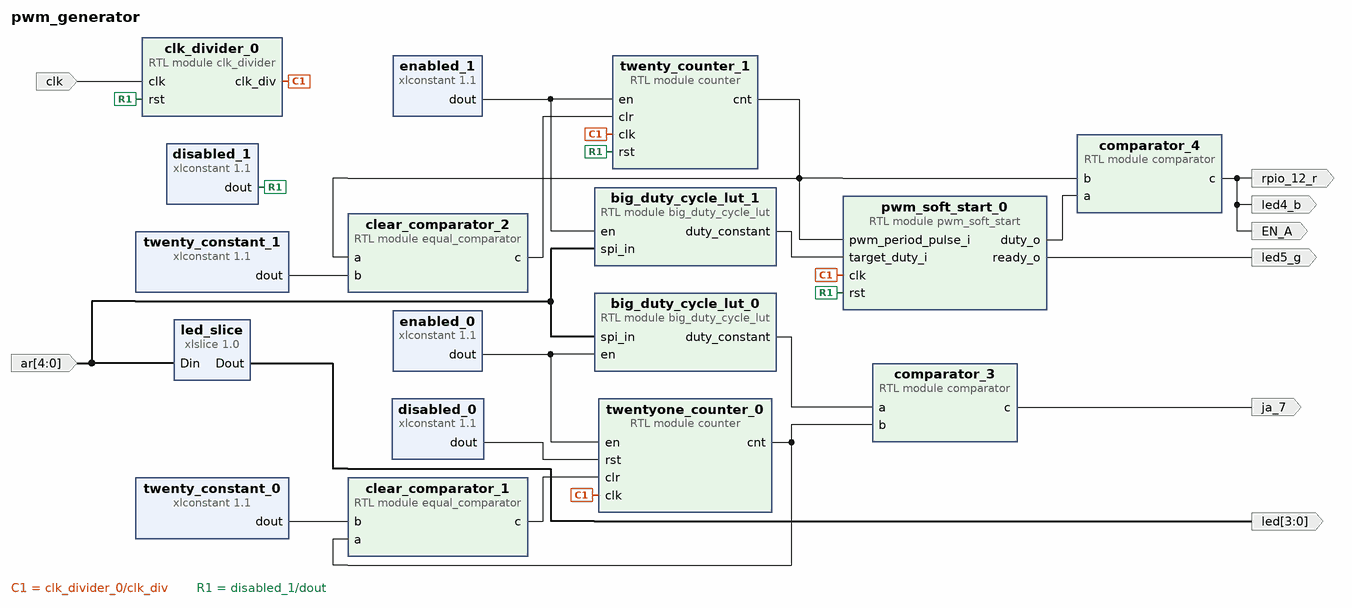
[diagram p0: block diagram of the top level]
# Vivado block design pwm_generator, xc7z020clg400-1, Vivado 2024.2
create_bd_design pwm_generator

create_bd_port -dir I -type clk clk
create_bd_port -dir O ja_7
create_bd_port -dir O EN_A
create_bd_port -dir O -from 3 -to 0 led
create_bd_port -dir O led5_g
create_bd_port -dir O rpio_12_r
create_bd_port -dir I -from 4 -to 0 ar
create_bd_port -dir O led4_b

create_bd_cell -type ip -vlnv xilinx.com:ip:xlconstant:1.1 enabled_0
create_bd_cell -type ip -vlnv xilinx.com:ip:xlconstant:1.1 disabled_0
set_property -dict {CONFIG.CONST_VAL 0} [get_bd_cells disabled_0]
create_bd_cell -type module -reference counter twentyone_counter_0
set_property -dict {CONFIG.n_bits 5} [get_bd_cells twentyone_counter_0]
create_bd_cell -type ip -vlnv xilinx.com:ip:xlconstant:1.1 twenty_constant_0
set_property -dict {CONFIG.CONST_VAL 20 CONFIG.CONST_WIDTH 5} [get_bd_cells twenty_constant_0]
create_bd_cell -type module -reference equal_comparator clear_comparator_1
set_property -dict {CONFIG.n_bits 5} [get_bd_cells clear_comparator_1]
create_bd_cell -type module -reference big_duty_cycle_lut big_duty_cycle_lut_0
create_bd_cell -type module -reference comparator comparator_3
set_property -dict {CONFIG.n_bits 5} [get_bd_cells comparator_3]
create_bd_cell -type module -reference big_duty_cycle_lut big_duty_cycle_lut_1
create_bd_cell -type module -reference equal_comparator clear_comparator_2
set_property -dict {CONFIG.n_bits 5} [get_bd_cells clear_comparator_2]
create_bd_cell -type module -reference comparator comparator_4
set_property -dict {CONFIG.n_bits 5} [get_bd_cells comparator_4]
create_bd_cell -type ip -vlnv xilinx.com:ip:xlconstant:1.1 disabled_1
set_property -dict {CONFIG.CONST_VAL 0} [get_bd_cells disabled_1]
create_bd_cell -type ip -vlnv xilinx.com:ip:xlconstant:1.1 enabled_1
create_bd_cell -type ip -vlnv xilinx.com:ip:xlconstant:1.1 twenty_constant_1
set_property -dict {CONFIG.CONST_VAL 20 CONFIG.CONST_WIDTH 5} [get_bd_cells twenty_constant_1]
create_bd_cell -type module -reference counter twenty_counter_1
set_property -dict {CONFIG.n_bits 5} [get_bd_cells twenty_counter_1]
create_bd_cell -type ip -vlnv xilinx.com:ip:xlslice:1.0 led_slice
set_property -dict {CONFIG.DIN_FROM 3 CONFIG.DIN_WIDTH 5} [get_bd_cells led_slice]
create_bd_cell -type module -reference clk_divider clk_divider_0
create_bd_cell -type module -reference pwm_soft_start pwm_soft_start_0
set_property -dict {CONFIG.UPDATE_DIV 100} [get_bd_cells pwm_soft_start_0]

# ---- connections ----

connect_bd_net [get_bd_pins big_duty_cycle_lut_0/duty_constant] [get_bd_pins comparator_3/a]
connect_bd_net [get_bd_pins big_duty_cycle_lut_1/duty_constant] [get_bd_pins pwm_soft_start_0/target_duty_i]
connect_bd_net [get_bd_ports clk] [get_bd_pins clk_divider_0/clk]
connect_bd_net [get_bd_pins clk_divider_0/clk_div] \
  [get_bd_pins twenty_counter_1/clk] [get_bd_pins twentyone_counter_0/clk] [get_bd_pins pwm_soft_start_0/clk]
connect_bd_net [get_bd_pins comparator_3/c] [get_bd_ports ja_7]
connect_bd_net -net comparator_3_c1 [get_bd_pins comparator_4/c] [get_bd_ports EN_A] [get_bd_ports rpio_12_r] [get_bd_ports led4_b]
connect_bd_net [get_bd_pins disabled_0/dout] [get_bd_pins twentyone_counter_0/rst]
connect_bd_net [get_bd_pins disabled_1/dout] [get_bd_pins twenty_counter_1/rst] [get_bd_pins clk_divider_0/rst] [get_bd_pins pwm_soft_start_0/rst]
connect_bd_net -net four_constant_0_dout [get_bd_pins twenty_constant_0/dout] [get_bd_pins clear_comparator_1/b]
connect_bd_net -net four_constant_0_dout1 [get_bd_pins twenty_constant_1/dout] [get_bd_pins clear_comparator_2/b]
connect_bd_net -net four_counter_0_cnt [get_bd_pins twentyone_counter_0/cnt] [get_bd_pins clear_comparator_1/a] [get_bd_pins comparator_3/b]
connect_bd_net -net four_counter_0_cnt1 [get_bd_pins twenty_counter_1/cnt] \
  [get_bd_pins clear_comparator_2/a] [get_bd_pins comparator_4/b] [get_bd_pins pwm_soft_start_0/pwm_period_pulse_i]
connect_bd_net [get_bd_pins led_slice/Dout] [get_bd_ports led]
connect_bd_net [get_bd_pins pwm_soft_start_0/duty_o] [get_bd_pins comparator_4/a]
connect_bd_net [get_bd_pins pwm_soft_start_0/ready_o] [get_bd_ports led5_g]
connect_bd_net -net pwm_test_switcher_0_out_1 [get_bd_ports ar] \
  [get_bd_pins big_duty_cycle_lut_0/spi_in] [get_bd_pins big_duty_cycle_lut_1/spi_in] [get_bd_pins led_slice/Din]
connect_bd_net -net reset_comparator_2_c [get_bd_pins clear_comparator_1/c] [get_bd_pins twentyone_counter_0/clr]
connect_bd_net -net reset_comparator_2_c1 [get_bd_pins clear_comparator_2/c] [get_bd_pins twenty_counter_1/clr]
connect_bd_net -net xlconstant_0_dout [get_bd_pins enabled_0/dout] [get_bd_pins twentyone_counter_0/en] [get_bd_pins big_duty_cycle_lut_0/en]
connect_bd_net -net xlconstant_0_dout1 [get_bd_pins enabled_1/dout] [get_bd_pins twenty_counter_1/en] [get_bd_pins big_duty_cycle_lut_1/en]

validate_bd_design
save_bd_design
